# Altium schematic sheet Connectors - AMS.SchDoc
size A4
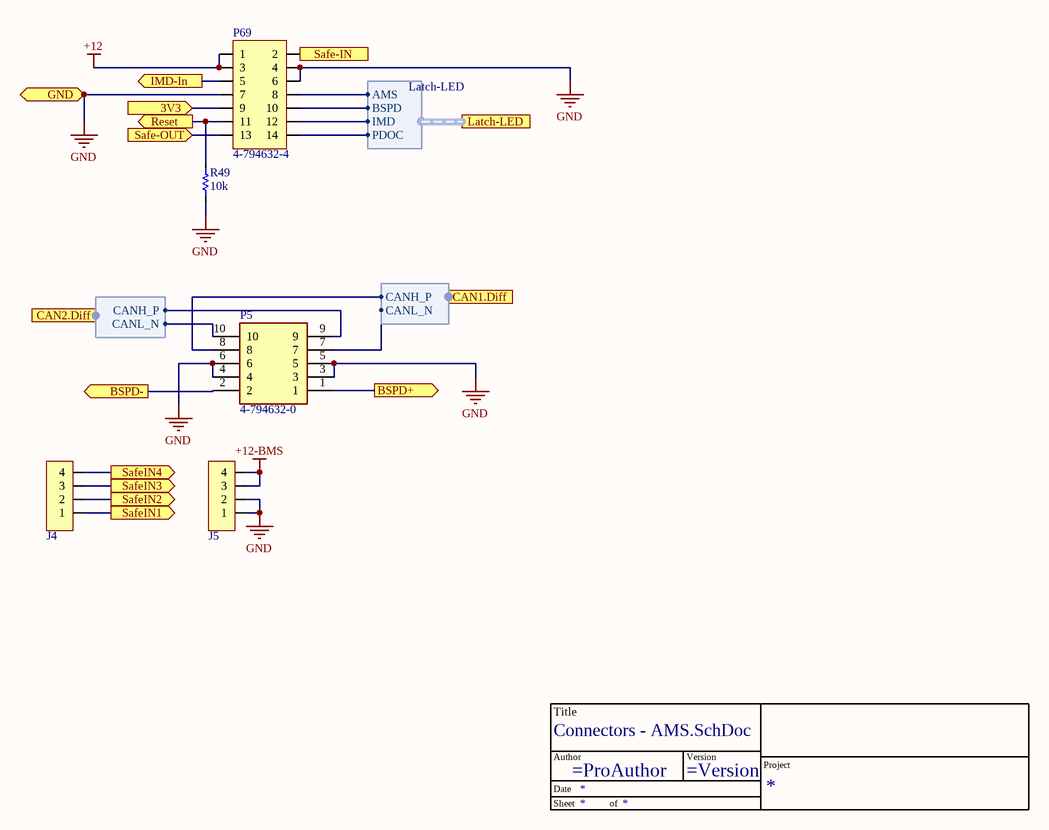
[diagram p0: Connectors - AMS.SchDoc]

## Parts
*?  TitleBlock  (value not drawn)  (graphical)
J4  3-794632-4  [3-794632-4]  (value not drawn)
J5  3-794632-4  [3-794632-4]  (value not drawn)
P5  4-794632-0  [SHDR10W82P300_2X5_1586X686X944P]
P69  4-794632-4  [4-794632-4]
R49  value 10k  [R-0603]  (hidden comment: RC0603FR-1310KL)

## Ports
3V3 (in), BSPD+ (out), BSPD- (out), CAN1.Diff (harness CANDiff), CAN2.Diff (harness CANDiff), GND (bidir), IMD-In (out), Latch-LED (harness Latch-LED), Reset (out), Safe-IN (out), Safe-OUT (in), SafeIN1 (out), SafeIN2 (out), SafeIN3 (out), SafeIN4 (out)

## Harnesses
CANDiff: CANH_P, CANL_N
Latch-LED: AMS, BSPD, IMD, PDOC

## Nets
+12: P69.1 P69.3
+12-BMS: J5.3 J5.4
GND: J5.1 J5.2 P5.3 P5.4 P5.5 P5.6 P69.4 P69.6 P69.7 R49.2 ; port GND
3V3: P69.9 ; port 3V3
BSPD+: P5.1 ; port BSPD+
BSPD-: P5.2 ; port BSPD-
IMD-In: P69.5 ; port IMD-In
Reset: P69.11 R49.1 ; port Reset
Safe-IN: P69.2 ; port Safe-IN
Safe-OUT: P69.13 ; port Safe-OUT
SafeIN1: J4.1 ; port SafeIN1
SafeIN2: J4.2 ; port SafeIN2
SafeIN3: J4.3 ; port SafeIN3
SafeIN4: J4.4 ; port SafeIN4
NetP5_7: P5.7 ; port CAN1.Diff.CANL_N
NetP5_8: P5.8 ; port CAN1.Diff.CANH_P
NetP5_9: P5.9 ; port CAN2.Diff.CANH_P
NetP5_10: P5.10 ; port CAN2.Diff.CANL_N
NetP69_8: P69.8 ; port Latch-LED.AMS
NetP69_10: P69.10 ; port Latch-LED.BSPD
NetP69_12: P69.12 ; port Latch-LED.IMD
NetP69_14: P69.14 ; port Latch-LED.PDOC

## Notes on the sheet
- (in symbol TitleBlock) Title; Author; Version; Project; Date; Sheet; of

## Library data of the parts
J4 J5 = 3-794632-4: Conn Power HDR 4 POS 3mm Solder ST Thru-Hole 4 Terminal 1 Port Box/Tray; Manufacturer: TE Connectivity; Number of Terminals/Pins: 4; Max Voltage Rating (AC): 250V; Connector Type: Pin; Mating Retention: Yes (With); PCB Mount Alignment: No (Without); Current Rating: 5A; Number of Ports: 1; Connector System: Wire-to-Board; PCB Mount Retention: With; PCB Mounting Orientation: Vertical; VDE Tested: Yes; Pitch: 0.118inch; Row Spacing: 0.118mm; PCB Thickness: 1.57mm; Plating Thickness: 2.54um; Approvals: CSA; Supplier 1: Mouser; Manufacturer Part Number: 3-794632-4; RoHS: Yes; Category: Power Connectors; Stock 1: 833; Pricing 1: 1=1.68000, 10=1.43000, 50=1.43000, 100=1.24000, 377=1.09000, 1000=1.09000, 1131=0.93600, 2639=0.87300, 5278=0.83000, 10000=0.83000, 10179=0.81100, 25259=0.79100 (USD); Mount: Through Hole; Housing Color: Black; Contact Material: Brass; Color: Black; Housing Material: Nylon; Contact Plating: Gold,Tin; Min Operating Temperature: -40°C; Max Operating Temperature: 221°C; Packaging: Tray; Package Quantity: 377; Number of Rows: 2; Fastening Type: Ramp; Orientation: Straight; Number of Positions: 4; Termination: Solder; Number of Contacts: 4; Voltage Rating: 250V; Contact Gender: Male; Mating Alignment: Yes (With); Contact Current Rating: 5A; Contact Retention: No (Without); Sealable: No (Without); Circuit Application: Power; Number of Power Positions: 4; Length: 10mm; Width: 9.24mm; Height: 8.67mm; Depth: 8.67mm; Radiation Hardening: No; Flammability Rating: UL94 V-0; Lead Free: Lead Free; ELV: Compliant; ComponentLink1URL: https://datasheet.ciiva.com/717/eng-cd-794632-e-717814.pdf?src-supplier=Digi-Key; ComponentLink1Description: https://datasheet.ciiva.com/717/eng-cd-794632-e-717814.pdf?src-supplier=Digi-Key; ComponentLink2URL: https://datasheet.ciiva.com/30185/eng-cs-82181-softshell-high-density-0508-30185662.pdf?src-supplier=Onlinecomponents.com; ComponentLink2Description: https://datasheet.ciiva.com/30185/eng-cs-82181-softshell-high-density-0508-30185662.pdf?src-supplier=Onlinecomponents.com; Supplier Part Number 1: 571-3-794632-4
P5 = 4-794632-0: Connector; Manufacturer_Name: TE Connectivity; Datasheet Link: https://www.mouser.com/ProductDetail/TE-Connectivity-AMP/4-794632-0?qs=Rd%252BN518myCyGOpGRvqIhCg%3D%3D; Height: 9.44mm; Manufacturer_Part_Number: 4-794632-0; Mouser Part Number: 571-4-794632-0; Mouser Price/Stock: https://www.mouser.co.uk/ProductDetail/TE-Connectivity-AMP/4-794632-0?qs=Rd%252BN518myCyGOpGRvqIhCg%3D%3D
P69 = 4-794632-4: Micro MATE-N-LOK, Rectangular Power Connectors, Header, Plug, Wire-to-Board, 14 Position
R49 = Resistor